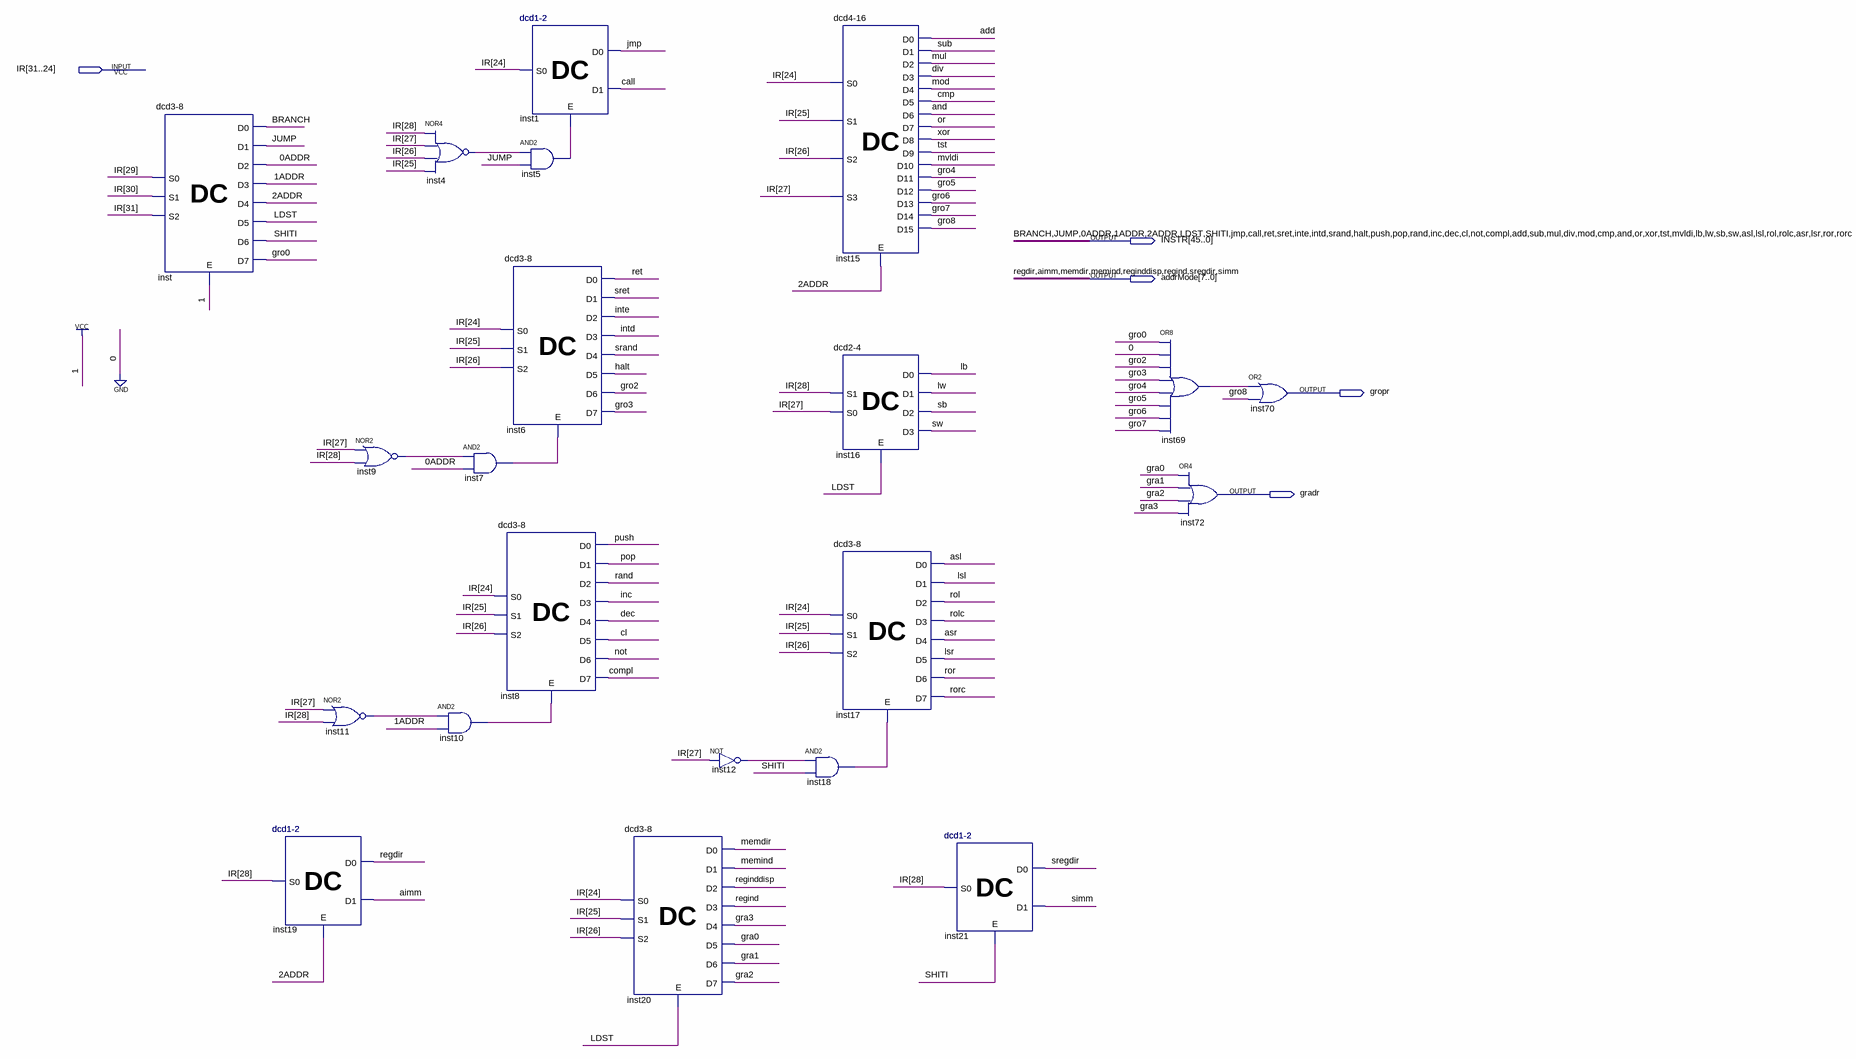
[diagram p0: schematic sheet]
// Quartus schematic kodoviOperacija.bdf as structural Verilog: 21 symbols, 5 pins
module kodoviOperacija (
  input  [31:24] IR,
  output [45:0] INSTR,
  output [7:0] addrMode,
  output gropr,
  output gradr
);

  wire gra0, gra1, gra2, gra3, gro0, gro2, gro3, gro4, gro5, gro6, gro7, gro8, inst4_out, inst5_out,
       inst7_out, inst9_out, inst10_out, inst11_out, inst12_out, inst18_out, inst69_out;

  \dcd3-8  inst (
    .E(1'b1), .S0(IR[29]), .S1(IR[30]), .S2(IR[31]), .D0(INSTR[45]), .D1(INSTR[44]), .D2(INSTR[43]),
    .D3(INSTR[42]), .D4(INSTR[41]), .D5(INSTR[40]), .D6(INSTR[39]), .D7(gro0));
  \dcd1-2  inst19 (.E(INSTR[41]), .S0(IR[28]), .D0(addrMode[7]), .D1(addrMode[6]));
  nor inst9 (inst9_out, IR[27], IR[28]);
  nor inst11 (inst11_out, IR[27], IR[28]);
  nor inst4 (inst4_out, IR[28], IR[27], IR[26], IR[25]);
  and inst7 (inst7_out, inst9_out, INSTR[43]);
  and inst10 (inst10_out, inst11_out, INSTR[42]);
  \dcd1-2  inst1 (.E(inst5_out), .S0(IR[24]), .D0(INSTR[38]), .D1(INSTR[37]));
  and inst5 (inst5_out, inst4_out, INSTR[44]);
  \dcd3-8  inst6 (
    .E(inst7_out), .S0(IR[24]), .S1(IR[25]), .S2(IR[26]), .D0(INSTR[36]), .D1(INSTR[35]), .D2(INSTR[34]),
    .D3(INSTR[33]), .D4(INSTR[32]), .D5(INSTR[31]), .D6(gro2), .D7(gro3));
  \dcd3-8  inst8 (
    .E(inst10_out), .S0(IR[24]), .S1(IR[25]), .S2(IR[26]), .D0(INSTR[30]), .D1(INSTR[29]), .D2(INSTR[28]),
    .D3(INSTR[27]), .D4(INSTR[26]), .D5(INSTR[25]), .D6(INSTR[24]), .D7(INSTR[23]));
  \dcd3-8  inst20 (
    .E(INSTR[40]), .S0(IR[24]), .S1(IR[25]), .S2(IR[26]), .D0(addrMode[5]), .D1(addrMode[4]),
    .D2(addrMode[3]), .D3(addrMode[2]), .D4(gra3), .D5(gra0), .D6(gra1), .D7(gra2));
  not inst12 (inst12_out, IR[27]);
  and inst18 (inst18_out, inst12_out, INSTR[39]);
  \dcd4-16  inst15 (
    .S0(IR[24]), .S1(IR[25]), .S2(IR[26]), .S3(IR[27]), .E(INSTR[41]), .D0(INSTR[22]), .D1(INSTR[21]),
    .D2(INSTR[20]), .D3(INSTR[19]), .D4(INSTR[18]), .D5(INSTR[17]), .D6(INSTR[16]), .D7(INSTR[15]),
    .D8(INSTR[14]), .D9(INSTR[13]), .D10(INSTR[12]), .D11(gro4), .D12(gro5), .D13(gro6), .D14(gro7),
    .D15(gro8));
  \dcd2-4  inst16 (
    .E(INSTR[40]), .S1(IR[28]), .S0(IR[27]), .D0(INSTR[11]), .D1(INSTR[10]), .D2(INSTR[9]), .D3(INSTR[8]));
  \dcd3-8  inst17 (
    .E(inst18_out), .S0(IR[24]), .S1(IR[25]), .S2(IR[26]), .D0(INSTR[7]), .D1(INSTR[6]), .D2(INSTR[5]),
    .D3(INSTR[4]), .D4(INSTR[3]), .D5(INSTR[2]), .D6(INSTR[1]), .D7(INSTR[0]));
  \dcd1-2  inst21 (.E(INSTR[39]), .S0(IR[28]), .D0(addrMode[1]), .D1(addrMode[0]));
  or inst69 (inst69_out, gro0, 1'b0, gro2, gro3, gro4, gro5, gro6, gro7);
  or inst72 (gradr, gra0, gra1, gra2, gra3);
  or inst70 (gropr, inst69_out, gro8);

  // Other names for the same wires on the sheet: 0ADDR = INSTR[43]; 1ADDR = INSTR[42]; 2ADDR = INSTR[41];
  //   add = INSTR[22]; aimm = addrMode[6]; and = INSTR[16]; asl = INSTR[7]; asr = INSTR[3]; BRANCH = INSTR[45];
  //   call = INSTR[37]; cl = INSTR[25]; cmp = INSTR[17]; compl = INSTR[23]; dec = INSTR[26]; div = INSTR[19];
  //   halt = INSTR[31]; inc = INSTR[27]; intd = INSTR[33]; inte = INSTR[34]; jmp = INSTR[38]; JUMP = INSTR[44];
  //   lb = INSTR[11]; LDST = INSTR[40]; lsl = INSTR[6]; lsr = INSTR[2]; lw = INSTR[10]; memdir = addrMode[5];
  //   memind = addrMode[4]; mod = INSTR[18]; mul = INSTR[20]; mvldi = INSTR[12]; not = INSTR[24]; or = INSTR[15];
  //   pop = INSTR[29]; push = INSTR[30]; rand = INSTR[28]; regdir = addrMode[7]; regind = addrMode[2];
  //   reginddisp = addrMode[3]; ret = INSTR[36]; rol = INSTR[5]; rolc = INSTR[4]; ror = INSTR[1]; rorc = INSTR[0];
  //   sb = INSTR[9]; SHITI = INSTR[39]; simm = addrMode[0]; srand = INSTR[32]; sregdir = addrMode[1];
  //   sret = INSTR[35]; sub = INSTR[21]; sw = INSTR[8]; tst = INSTR[13]; xor = INSTR[14]
endmodule
